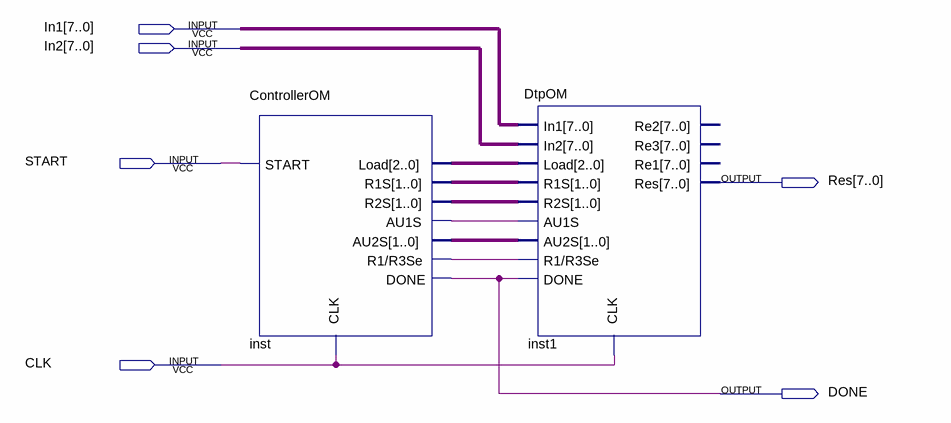
[diagram p0: schematic sheet]
// Quartus schematic OM.bdf as structural Verilog: 2 symbols, 6 pins
module OM (
  input  [7:0] In1,
  input  [7:0] In2,
  input  START,
  input  CLK,
  output [7:0] Res,
  output DONE
);

  wire inst_au1s, inst_r1_r3se;
  wire [1:0] inst_au2s, inst_r1s, inst_r2s;
  wire [2:0] inst_load;

  ControllerOM inst (
    .START(START), .CLK(CLK), .Load(inst_load), .R1S(inst_r1s), .R2S(inst_r2s), .AU1S(inst_au1s),
    .AU2S(inst_au2s), .\R1/R3Se (inst_r1_r3se), .DONE(DONE));
  DtpOM inst1 (
    .In1(In1), .In2(In2), .Load(inst_load), .R1S(inst_r1s), .R2S(inst_r2s), .AU1S(inst_au1s),
    .AU2S(inst_au2s), .\R1/R3Se (inst_r1_r3se), .DONE(DONE), .CLK(CLK), .Res(Res));  // open: Re2, Re3, Re1
endmodule
